# Altium schematic sheet Soft Quad Schematic.SchDoc
size A4; SheetNumber: 1; SheetTotal: 1
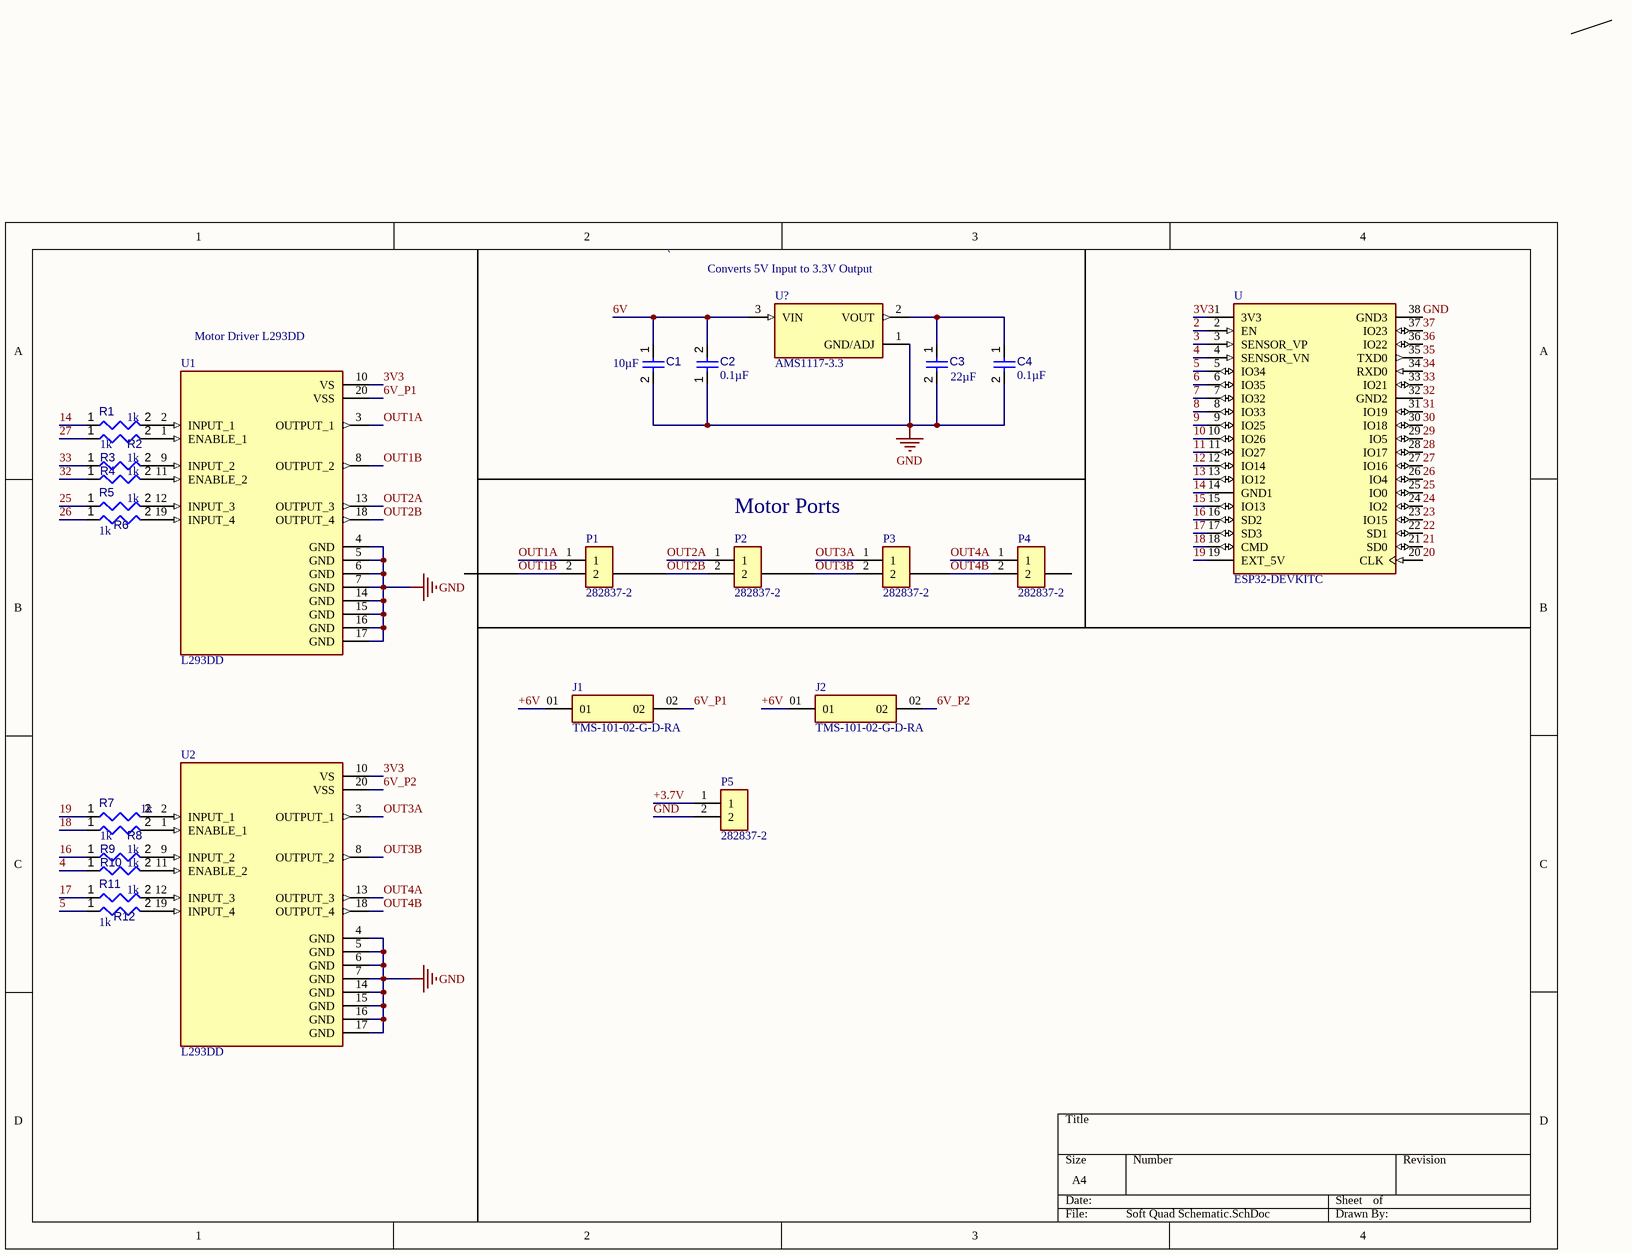
[diagram p0: Soft Quad Schematic.SchDoc]

## Parts
C1  value 10µF  [CAPC3216X180X50NL20T25]  (hidden comment: Capacitor 10 uF +/- 10% 16 V 1206)
C2  value 0.1µF  [CAPC3216X180X50NL20T25]  (hidden comment: Capacitor 10 uF +/- 10% 16 V 1206)
C3  value 22µF  [CAPC3216X180X50NL20T25]  (hidden comment: Capacitor 10 uF +/- 10% 16 V 1206)
C4  value 0.1µF  [CAPC3216X180X50NL20T25]  (hidden comment: Capacitor 10 uF +/- 10% 16 V 1206)
J1  TMS-101-02-G-D-RA  [SAMTEC_TMS-101-02-G-D-RA]
J2  TMS-101-02-G-D-RA  [SAMTEC_TMS-101-02-G-D-RA]
P1  282837-2  [TE_282837-2]
P2  282837-2  [TE_282837-2]
P3  282837-2  [TE_282837-2]
P4  282837-2  [TE_282837-2]
P5  282837-2  [TE_282837-2]
R1  value 1k  [RESC1608X55X25ML10T15]  (hidden comment: Resistor 1k +/-1% 0603 100 mW)
R2  value 1k  [RESC1608X55X25ML10T15]  (hidden comment: Resistor 1k +/-1% 0603 100 mW)
R3  value 1k  [RESC1608X55X25ML10T15]  (hidden comment: Resistor 1k +/-1% 0603 100 mW)
R4  value 1k  [RESC1608X55X25ML10T15]  (hidden comment: Resistor 1k +/-1% 0603 100 mW)
R5  value 1k  [RESC1608X55X25ML10T15]  (hidden comment: Resistor 1k +/-1% 0603 100 mW)
R6  value 1k  [RESC1608X55X25ML10T15]  (hidden comment: Resistor 1k +/-1% 0603 100 mW)
R7  value 1k  [RESC1608X55X25ML10T15]  (hidden comment: Resistor 1k +/-1% 0603 100 mW)
R8  value 1k  [RESC1608X55X25ML10T15]  (hidden comment: Resistor 1k +/-1% 0603 100 mW)
R9  value 1k  [RESC1608X55X25ML10T15]  (hidden comment: Resistor 1k +/-1% 0603 100 mW)
R10  value 1k  [RESC1608X55X25ML10T15]  (hidden comment: Resistor 1k +/-1% 0603 100 mW)
R11  value 1k  [RESC1608X55X25ML10T15]  (hidden comment: Resistor 1k +/-1% 0603 100 mW)
R12  value 1k  [RESC1608X55X25ML10T15]  (hidden comment: Resistor 1k +/-1% 0603 100 mW)
U  ESP32-DEVKITC  [MODULE_ESP32-DEVKITC]
U1  L293DD  [SOIC127P1032X265-20N]
U2  L293DD  [SOIC127P1032X265-20N]
U?  AMS1117-3.3  [SOT229P700X180-4N]

## Nets
GND: C1.2 C2.1 C3.2 C4.2 P5.2 U.38(GND3) U1.4(GND) U1.5(GND) U1.6(GND) U1.7(GND) U1.14(GND) U1.15(GND) U1.16(GND) U1.17(GND) U2.4(GND) U2.5(GND) U2.6(GND) U2.7(GND) U2.14(GND) U2.15(GND) U2.16(GND) U2.17(GND) U?.1(GND/ADJ)
2: U.2(EN)
3: U.3(SENSOR_VP)
3V3: U.1(3V3) U1.10(VS) U2.10(VS)
4: R10.1 U.4(SENSOR_VN)
5: R12.1 U.5(IO34)
6: U.6(IO35)
6V: C1.1 C2.2 U?.3(VIN)
6V_P1: J1.02 U1.20(VSS)
6V_P2: J2.02 U2.20(VSS)
7: U.7(IO32)
8: U.8(IO33)
9: U.9(IO25)
10: U.10(IO26)
11: U.11(IO27)
12: U.12(IO14)
13: U.13(IO12)
14: R1.1 U.14(GND1)
15: U.15(IO13)
16: R9.1 U.16(SD2)
17: R11.1 U.17(SD3)
18: R8.1 U.18(CMD)
19: R7.1 U.19(EXT_5V)
20: U.20(CLK)
21: U.21(SD0)
22: U.22(SD1)
23: U.23(IO15)
24: U.24(IO2)
25: R5.1 U.25(IO0)
26: R6.1 U.26(IO4)
27: R2.1 U.27(IO16)
28: U.28(IO17)
29: U.29(IO5)
30: U.30(IO18)
31: U.31(IO19)
32: R4.1 U.32(GND2)
33: R3.1 U.33(IO21)
34: U.34(RXD0)
35: U.35(TXD0)
36: U.36(IO22)
37: U.37(IO23)
+3.7V: P5.1
+6V: J1.01 J2.01
OUT1A: P1.1 U1.3(OUTPUT_1)
OUT1B: P1.2 U1.8(OUTPUT_2)
OUT2A: P2.1 U1.13(OUTPUT_3)
OUT2B: P2.2 U1.18(OUTPUT_4)
OUT3A: P3.1 U2.3(OUTPUT_1)
OUT3B: P3.2 U2.8(OUTPUT_2)
OUT4A: P4.1 U2.13(OUTPUT_3)
OUT4B: P4.2 U2.18(OUTPUT_4)
NetC3_1: C3.1 C4.1 U?.2(VOUT)
NetR1_2: R1.2 U1.2(INPUT_1)
NetR2_2: R2.2 U1.1(ENABLE_1)
NetR3_2: R3.2 U1.9(INPUT_2)
NetR4_2: R4.2 U1.11(ENABLE_2)
NetR5_2: R5.2 U1.12(INPUT_3)
NetR6_2: R6.2 U1.19(INPUT_4)
NetR7_2: R7.2 U2.2(INPUT_1)
NetR8_2: R8.2 U2.1(ENABLE_1)
NetR9_2: R9.2 U2.9(INPUT_2)
NetR10_2: R10.2 U2.11(ENABLE_2)
NetR11_2: R11.2 U2.12(INPUT_3)
NetR12_2: R12.2 U2.19(INPUT_4)

## Notes on the sheet
- `
- (near U?) Converts 5V Input to 3.3V Output
- (near U1) Motor Driver L293DD
- Motor Ports

## Library data of the parts
C1-C4 = CMP-001-00016-6: Chip Capacitor, 10 uF, +/- 10%, 16 V, 1206 (3216 Metric); Capacitor Type: Ceramic; Voltage Rating: 16V; Tolerance: 10%; Min Operating Temperature: -55°C; Pins: 2; Mounting Technology: SM; Case/Package: 1206; Max Operating Temperature: 125°C; RoHS Compliant: True
P1-P5 = 282837-2: Ð Ð°Ð·ÑŠÐµÐ¼Ð½Ñ‹Ðµ ÐºÐ»ÐµÐ¼Ð¼Ð½Ñ‹Ðµ ÐºÐ¾Ð»Ð¾Ð´ÐºÐ¸ Ð Ð¾Ð·ÐµÑ‚ÐºÐ° 2 Ð¿Ð¾Ð»Ð¾Ð¶ÐµÐ½Ð¸Ñ 5,08 Ð¼Ð¼ ÐŸÑ€Ð¸Ð¿Ð¾Ð¹ Ð¿Ñ€ÑÐ¼Ð¾Ð¹ Ñ‡ÐµÑ€ÐµÐ· Ð¾Ñ‚Ð²ÐµÑ€ÑÑ‚Ð¸Ðµ 13,5 Ð / ÐºÐ¾Ð½Ñ‚Ð°ÐºÑ‚; MF: TE Connectivity; SnapEDA_Link: https://www.snapeda.com/parts/282837-2/TE+Connectivity+AMP+Connectors/view-part/?ref=snap; Price: None; Check_prices: https://www.snapeda.com/parts/282837-2/TE+Connectivity+AMP+Connectors/view-part/?ref=eda; Purchase-URL: https://pricing.snapeda.com/search/part/282837-2/?ref=eda; MP: 282837-2; Value: *; Availability: In Stock; Package: None
R1-R12 = CMP-009-00014-5: Chip Resistor, 1 KOhm, +/-1%, 0.1 W, -55 to 155 degC, 0603 (1608 Metric); Voltage Rating: 50V; Power: 100mW; Tolerance: 1%; Mounting Technology: SM; Pins: 2; Case/Package: 0603; Min Operating Temperature: -55°C; RoHS Compliant: True; Max Operating Temperature: 155°C
U = ESP32-DEVKITC: - Transceiver; 802.11 b/g/n _Wi-Fi, WiFi, WLAN_, BluetoothÂ® Smart Ready 4.x Dual Mode For Use With ESP-WROOM-32; MP: ESP32-DEVKITC-32D-F; MF: Espressif Systems; Price: None; SnapEDA_Link: https://www.snapeda.com/parts/ESP32-DEVKITC-32D-F/Espressif%20Systems/view-part/4220172/?ref=snap; Availability: Unavailable; Value: *; Package: None
U1 U2 = L293DD: Bipolar Motor Driver Parallel 20-SOIC; MF: STMicroelectronics; Package: SOIC-20 STMicroelectronics; SnapEDA_Link: https://www.snapeda.com/parts/L293DD/STMicroelectronics/view-part/585585/?ref=snap; MP: L293DD; Value: *; Availability: Unavailable; Price: None
U? = AMS1117-3.3: Sot223/Pkg 1-Amp 3.3-Volt Low Drop Out Voltage Regulatator; MF: Advanced Monolithic Systems; Package: SOT-223 Seeed Technology; Value: *; Check_prices: https://www.snapeda.com/parts/AMS1117-3.3/Advanced+Monolithic+Systems/view-part/?ref=eda; Price: None; Availability: Not in stock; MP: AMS1117-3.3; SnapEDA_Link: https://www.snapeda.com/parts/AMS1117-3.3/Advanced+Monolithic+Systems/view-part/?ref=snap
J1 J2 = TMS-101-02-G-D-RA: Package: None; Price: None; Value: *; MP: TMS-101-02-G-D-RA; Availability: Unavailable